# EAGLE schematic 8_bit_Right_Rev_A (EAGLE 9.6.0)

## Sheet 1 of 6: PC
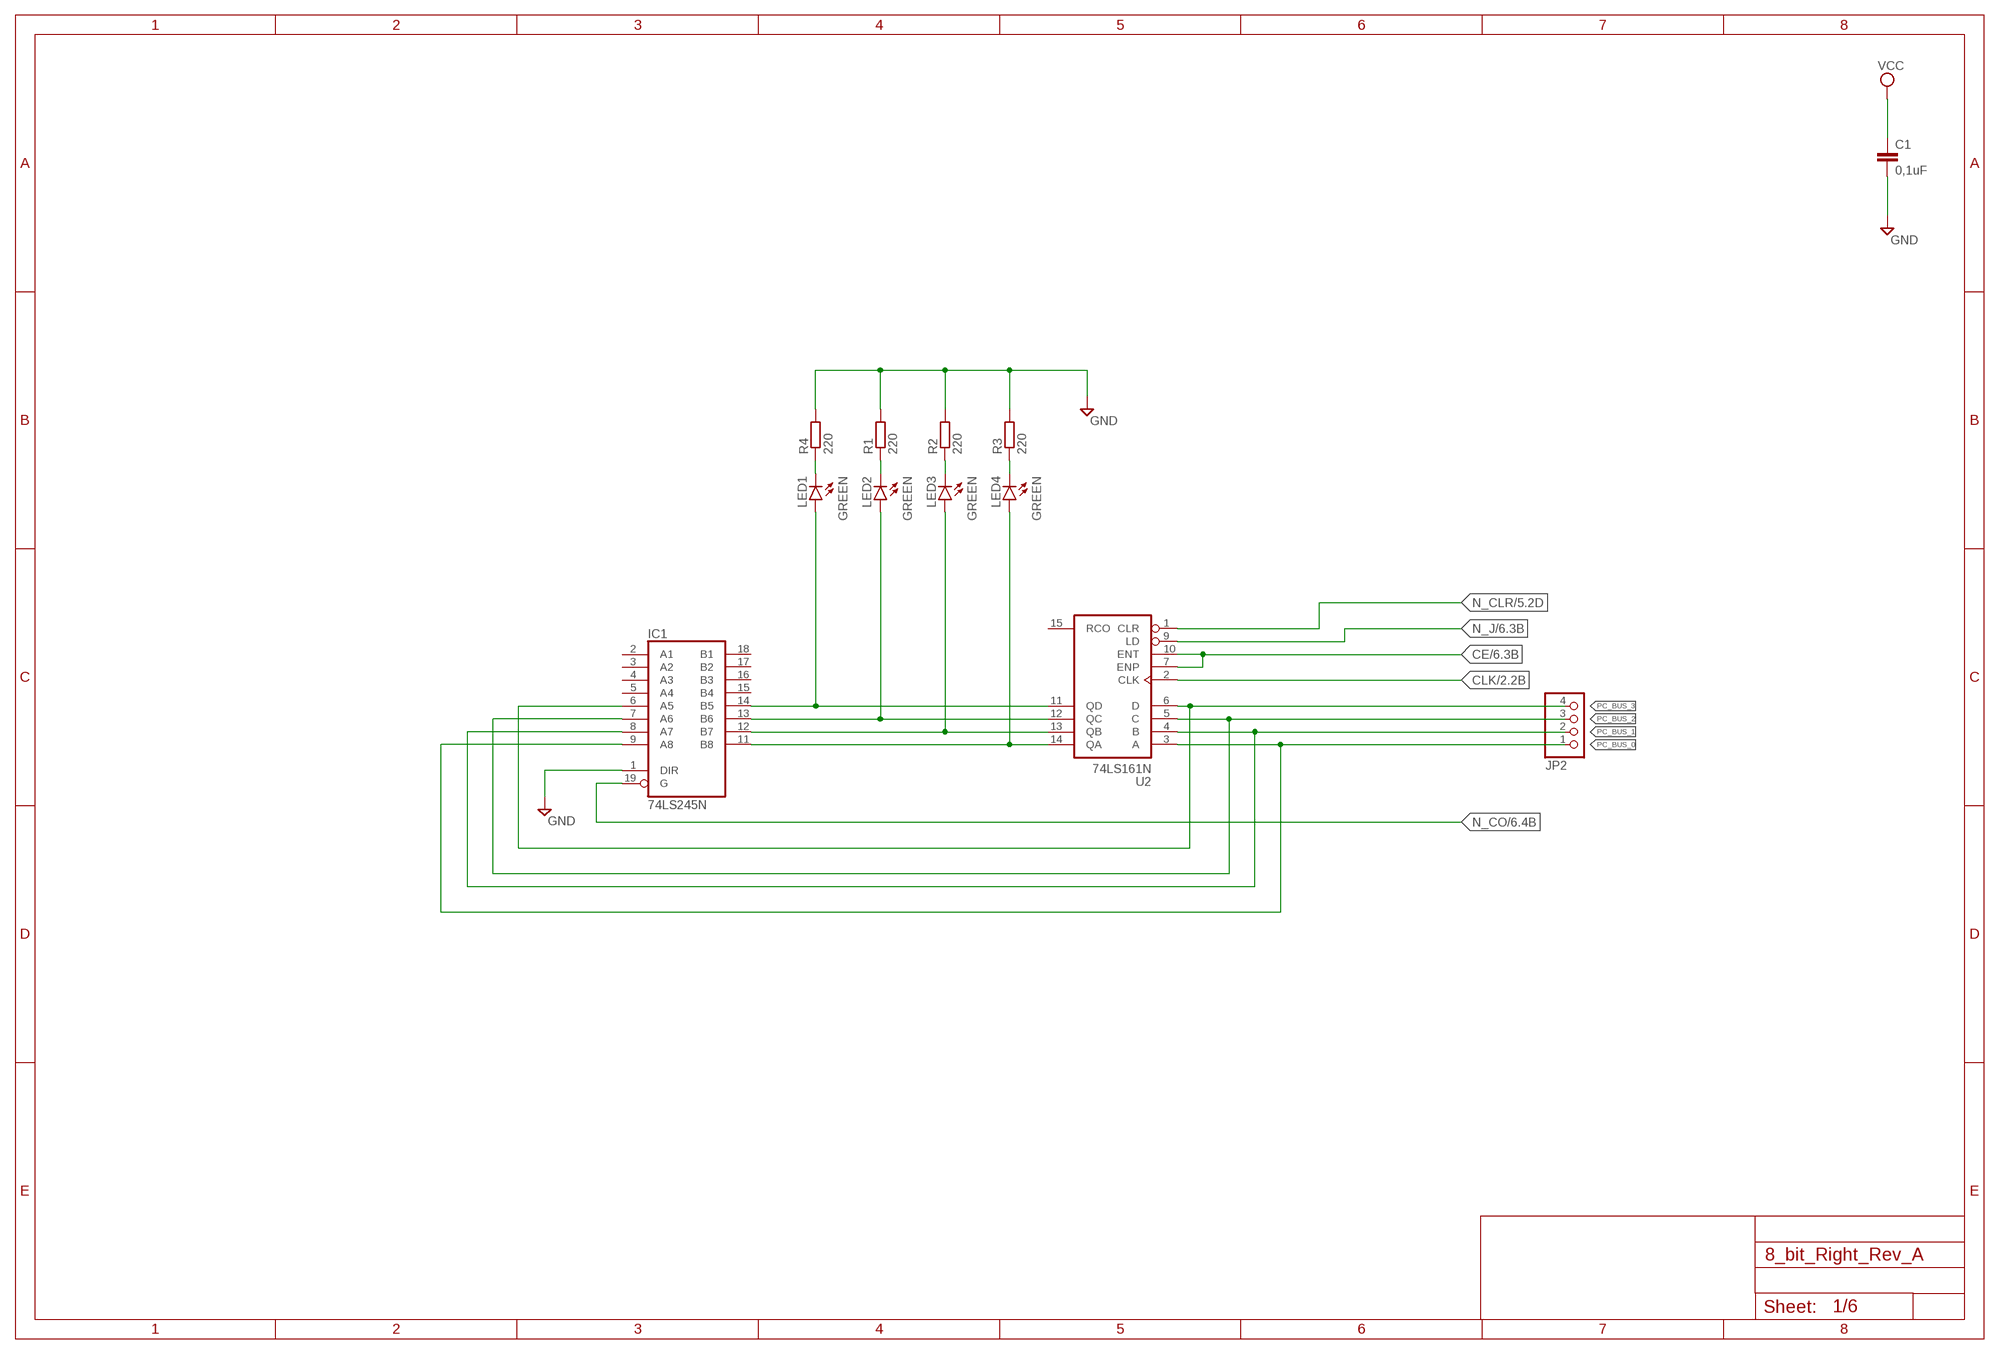
[diagram p0: schematic, sheet 1]

### Parts
C1  0,1uF  C-EU025-030X050  [C025-030X050]
IC1  74LS245N  [DIL20]
JP2  PINHD-1X4  [1X04]
LED1  GREEN  LED5MM  [LED5MM]
LED2  GREEN  LED5MM  [LED5MM]
LED3  GREEN  LED5MM  [LED5MM]
LED4  GREEN  LED5MM  [LED5MM]
R1  220  R-EU_0207/10  [0207/10]
R2  220  R-EU_0207/10  [0207/10]
R3  220  R-EU_0207/10  [0207/10]
R4  220  R-EU_0207/10  [0207/10]
U2  74LS161N  [DIL16]

### Nets
CE: U2.7(ENP) U2.10(ENT) ; also sheet 6
CLK: U2.2(CLK) ; also sheet 2,3,4,5,6
GND: C1.2 IC1.1(DIR) R1.2 R2.2 R3.2 R4.2 ; also sheet 2,3,4,5,6
N$1: LED1.K(C) R4.1
N$2: LED2.K(C) R1.1
N$3: LED3.K(C) R2.1
N$4: LED4.K(C) R3.1
N$5: IC1.11(B8) LED4.A U2.14(QA)
N$6: IC1.12(B7) LED3.A U2.13(QB)
N$7: IC1.13(B6) LED2.A U2.12(QC)
N$8: IC1.14(B5) LED1.A U2.11(QD)
N_CLR: U2.1(CLR) ; also sheet 5,6
N_CO: IC1.19(G) ; also sheet 6
N_J: U2.9(LD) ; also sheet 6
PC_BUS_0: IC1.9(A8) JP2.1 U2.3(A)
PC_BUS_1: IC1.8(A7) JP2.2 U2.4(B)
PC_BUS_2: IC1.7(A6) JP2.3 U2.5(C)
PC_BUS_3: IC1.6(A5) JP2.4 U2.6(D)
VCC: C1.1 ; also sheet 2,3,4,5,6
Unconnected: IC1.2(A1) IC1.3(A2) IC1.4(A3) IC1.5(A4) IC1.15(B4) IC1.16(B3) IC1.17(B2) IC1.18(B1) U2.15(RCO)

## Sheet 2 of 6: A_Register
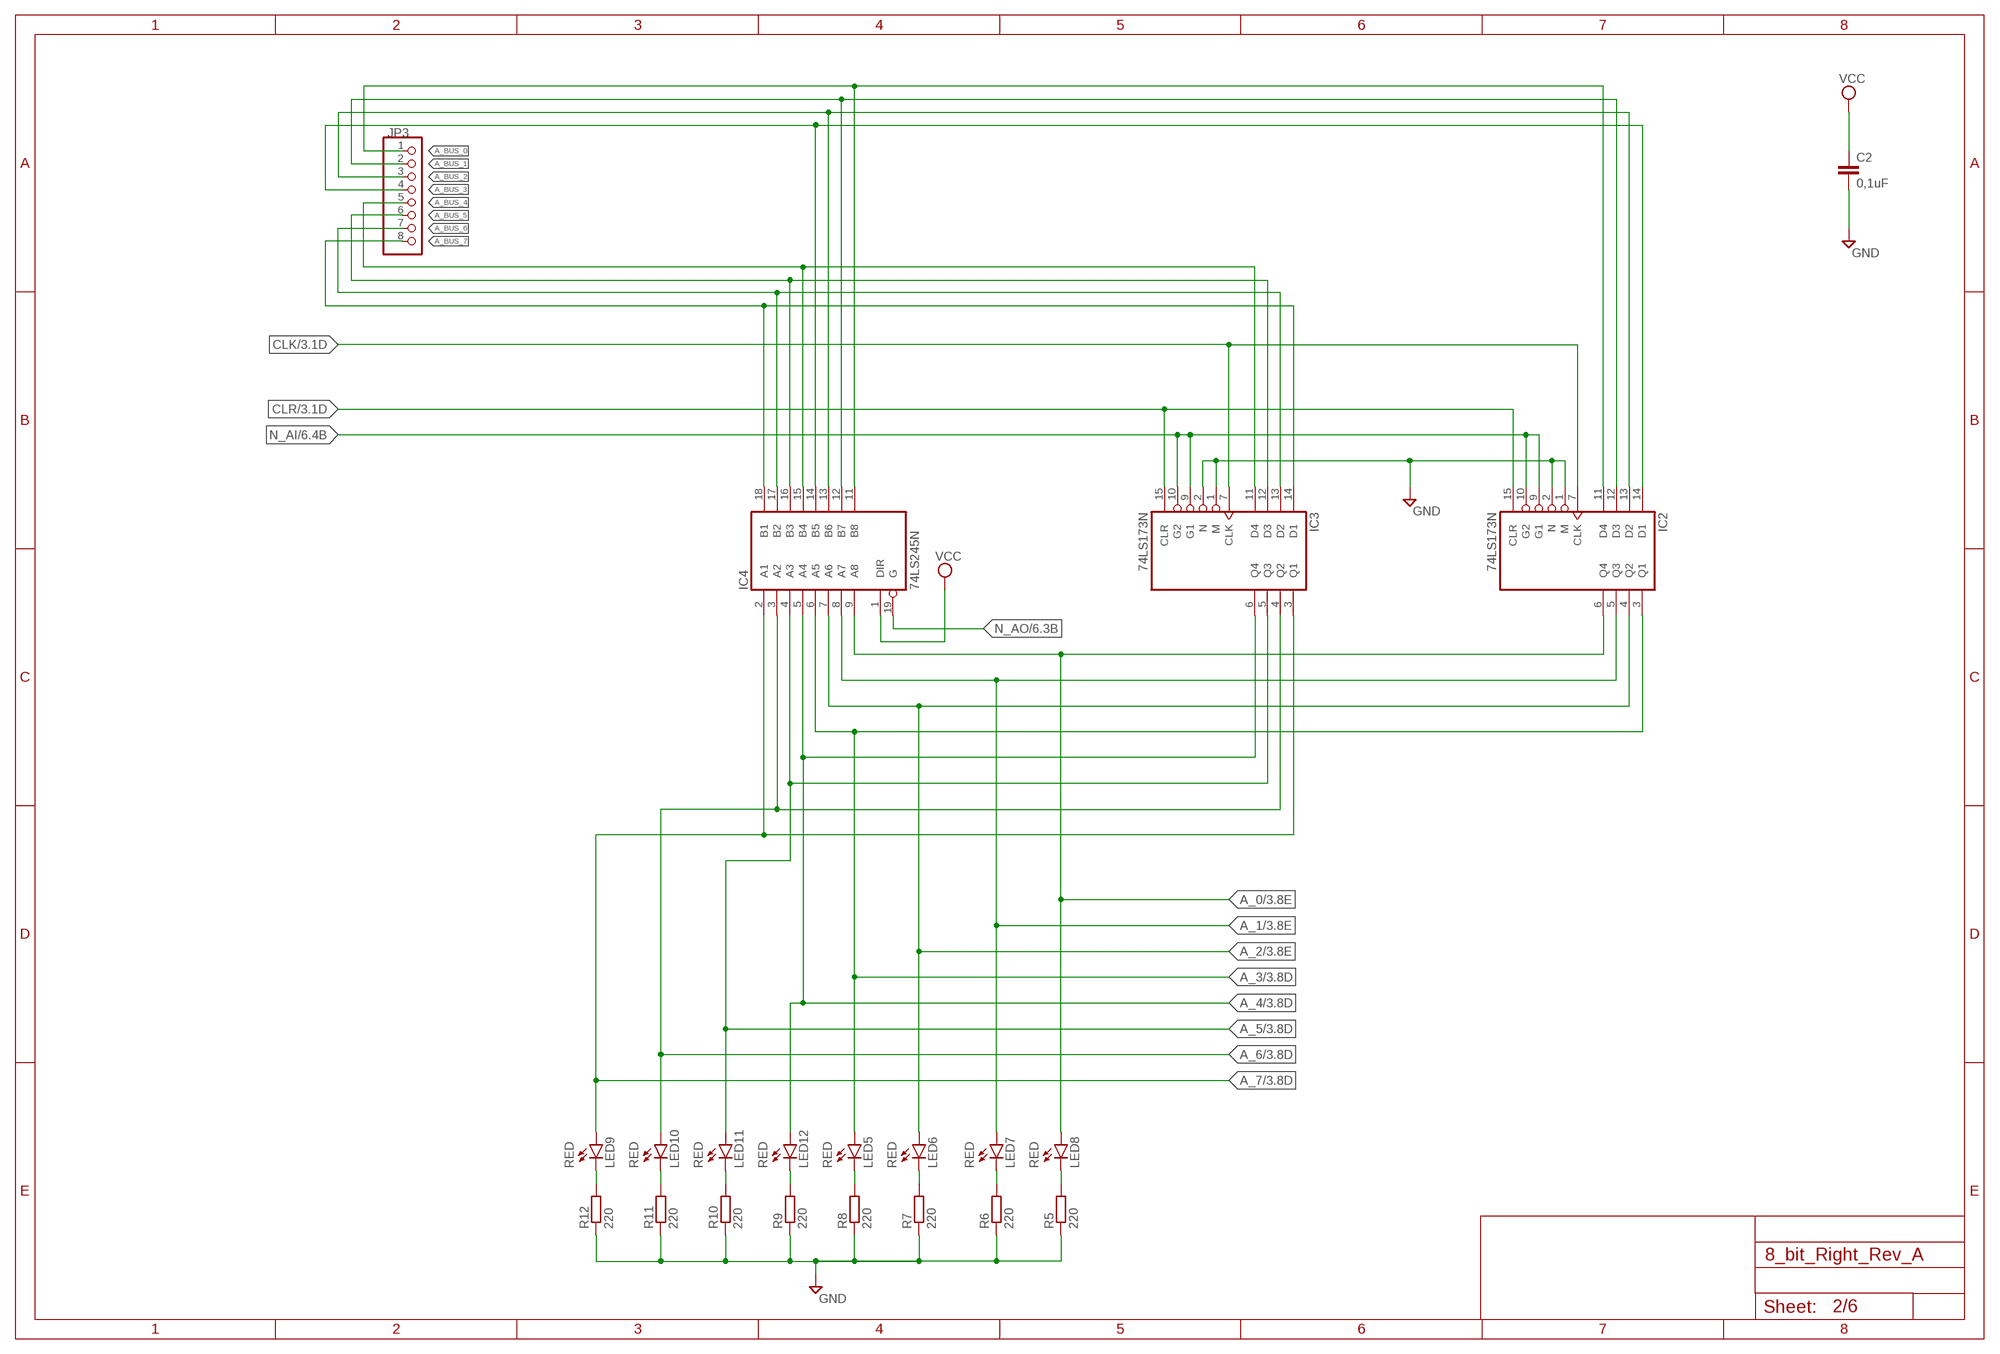
[diagram p1: schematic, sheet 2]

### Parts
C2  0,1uF  C-EU025-030X050  [C025-030X050]
IC2  74LS173N  [DIL16]
IC3  74LS173N  [DIL16]
IC4  74LS245N  [DIL20]
JP3  PINHD-1X8  [1X08]
LED5  RED  LED5MM  [LED5MM]
LED6  RED  LED5MM  [LED5MM]
LED7  RED  LED5MM  [LED5MM]
LED8  RED  LED5MM  [LED5MM]
LED9  RED  LED5MM  [LED5MM]
LED10  RED  LED5MM  [LED5MM]
LED11  RED  LED5MM  [LED5MM]
LED12  RED  LED5MM  [LED5MM]
R5  220  R-EU_0207/10  [0207/10]
R6  220  R-EU_0207/10  [0207/10]
R7  220  R-EU_0207/10  [0207/10]
R8  220  R-EU_0207/10  [0207/10]
R9  220  R-EU_0207/10  [0207/10]
R10  220  R-EU_0207/10  [0207/10]
R11  220  R-EU_0207/10  [0207/10]
R12  220  R-EU_0207/10  [0207/10]

### Nets
A_0: IC2.6(Q4) IC4.9(A8) LED8.A ; also sheet 3
A_1: IC2.5(Q3) IC4.8(A7) LED7.A ; also sheet 3
A_2: IC2.4(Q2) IC4.7(A6) LED6.A ; also sheet 3
A_3: IC2.3(Q1) IC4.6(A5) LED5.A ; also sheet 3
A_4: IC3.6(Q4) IC4.5(A4) LED12.A ; also sheet 3
A_5: IC3.5(Q3) IC4.4(A3) LED11.A ; also sheet 3
A_6: IC3.4(Q2) IC4.3(A2) LED10.A ; also sheet 3
A_7: IC3.3(Q1) IC4.2(A1) LED9.A ; also sheet 3
A_BUS_0: IC2.11(D4) IC4.11(B8) JP3.1
A_BUS_1: IC2.12(D3) IC4.12(B7) JP3.2
A_BUS_2: IC2.13(D2) IC4.13(B6) JP3.3
A_BUS_3: IC2.14(D1) IC4.14(B5) JP3.4
A_BUS_4: IC3.11(D4) IC4.15(B4) JP3.5
A_BUS_5: IC3.12(D3) IC4.16(B3) JP3.6
A_BUS_6: IC3.13(D2) IC4.17(B2) JP3.7
A_BUS_7: IC3.14(D1) IC4.18(B1) JP3.8
CLK: IC2.7(CLK) IC3.7(CLK) ; also sheet 1,3,4,5,6
CLR: IC2.15(CLR) IC3.15(CLR) ; also sheet 3,4
GND: C2.2 IC2.1(M) IC2.2(N) IC3.1(M) IC3.2(N) R5.1 R6.1 R7.1 R8.1 R9.1 R10.1 R11.1 R12.1 ; also sheet 1,3,4,5,6
GND1: LED8.K(C) R5.2
GND2: LED7.K(C) R6.2
GND3: LED6.K(C) R7.2
GND4: LED5.K(C) R8.2
GND5: LED12.K(C) R9.2
GND6: LED11.K(C) R10.2
GND7: LED10.K(C) R11.2
GND8: LED9.K(C) R12.2
N_AI: IC2.9(G1) IC2.10(G2) IC3.9(G1) IC3.10(G2) ; also sheet 6
N_AO: IC4.19(G) ; also sheet 6
VCC: C2.1 IC4.1(DIR) ; also sheet 1,3,4,5,6

## Sheet 3 of 6: Arthemtical Logic Unit
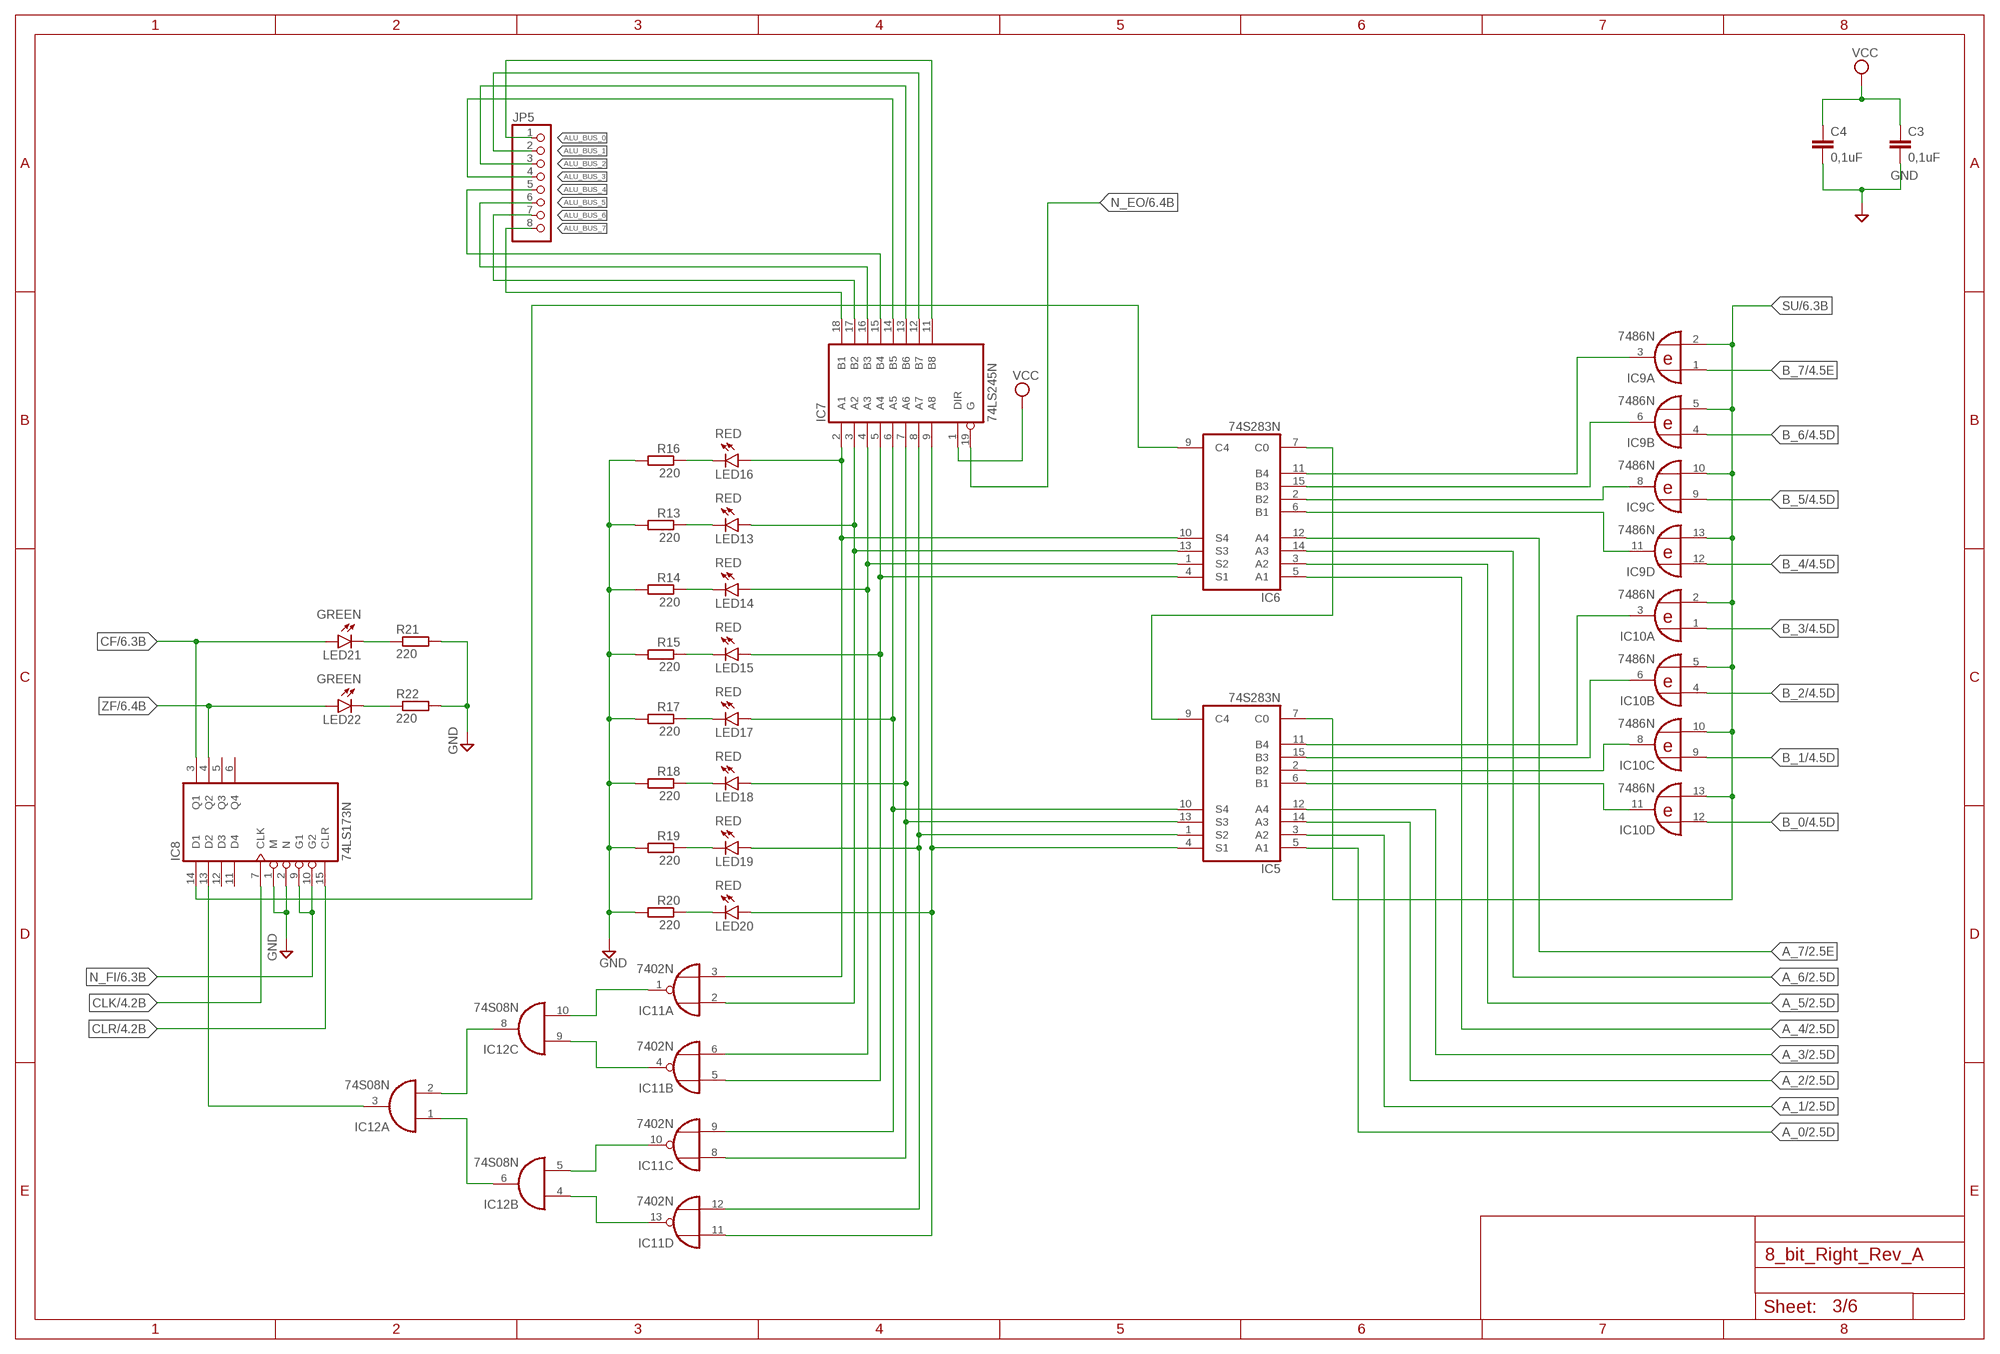
[diagram p2: schematic, sheet 3]

### Parts
C3  0,1uF  C-EU025-030X050  [C025-030X050]
C4  0,1uF  C-EU025-030X050  [C025-030X050]
IC5  74S283N  [DIL16]
IC6  74S283N  [DIL16]
IC7  74LS245N  [DIL20]
IC8  74LS173N  [DIL16]
IC9  7486N  [DIL14]
IC10  7486N  [DIL14]
IC11  7402N  [DIL14]
IC12  74S08N  [DIL14]
JP5  PINHD-1X8  [1X08]
LED13  RED  LED5MM  [LED5MM]
LED14  RED  LED5MM  [LED5MM]
LED15  RED  LED5MM  [LED5MM]
LED16  RED  LED5MM  [LED5MM]
LED17  RED  LED5MM  [LED5MM]
LED18  RED  LED5MM  [LED5MM]
LED19  RED  LED5MM  [LED5MM]
LED20  RED  LED5MM  [LED5MM]
LED21  GREEN  LED5MM  [LED5MM]
LED22  GREEN  LED5MM  [LED5MM]
R13  220  R-EU_0207/10  [0207/10]
R14  220  R-EU_0207/10  [0207/10]
R15  220  R-EU_0207/10  [0207/10]
R16  220  R-EU_0207/10  [0207/10]
R17  220  R-EU_0207/10  [0207/10]
R18  220  R-EU_0207/10  [0207/10]
R19  220  R-EU_0207/10  [0207/10]
R20  220  R-EU_0207/10  [0207/10]
R21  220  R-EU_0207/10  [0207/10]
R22  220  R-EU_0207/10  [0207/10]

### Nets
A_0: IC5.5(A1) ; also sheet 2
A_1: IC5.3(A2) ; also sheet 2
A_2: IC5.14(A3) ; also sheet 2
A_3: IC5.12(A4) ; also sheet 2
A_4: IC6.5(A1) ; also sheet 2
A_5: IC6.3(A2) ; also sheet 2
A_6: IC6.14(A3) ; also sheet 2
A_7: IC6.12(A4) ; also sheet 2
ALU_BUS_0: IC7.11(B8) JP5.1
ALU_BUS_1: IC7.12(B7) JP5.2
ALU_BUS_2: IC7.13(B6) JP5.3
ALU_BUS_3: IC7.14(B5) JP5.4
ALU_BUS_4: IC7.15(B4) JP5.5
ALU_BUS_5: IC7.16(B3) JP5.6
ALU_BUS_6: IC7.17(B2) JP5.7
ALU_BUS_7: IC7.18(B1) JP5.8
B_0: IC10.12(D:I0) ; also sheet 4
B_1: IC10.9(C:I0) ; also sheet 4
B_2: IC10.4(B:I0) ; also sheet 4
B_3: IC10.1(A:I0) ; also sheet 4
B_4: IC9.12(D:I0) ; also sheet 4
B_5: IC9.9(C:I0) ; also sheet 4
B_6: IC9.4(B:I0) ; also sheet 4
B_7: IC9.1(A:I0) ; also sheet 4
CF: IC8.3(Q1) LED21.A ; also sheet 6
CLK: IC8.7(CLK) ; also sheet 1,2,4,5,6
CLR: IC8.15(CLR) ; also sheet 2,4
GND: C3.2 C4.2 IC8.1(M) IC8.2(N) R13.2 R14.2 R15.2 R16.2 R17.2 R18.2 R19.2 R20.2 R21.2 R22.2 ; also sheet 1,2,4,5,6
N$9: IC5.9(C4) IC6.7(C0)
N$10: IC6.11(B4) IC9.3(A:O)
N$11: IC6.15(B3) IC9.6(B:O)
N$12: IC6.2(B2) IC9.8(C:O)
N$13: IC6.6(B1) IC9.11(D:O)
N$14: IC5.11(B4) IC10.3(A:O)
N$15: IC5.15(B3) IC10.6(B:O)
N$16: IC5.2(B2) IC10.8(C:O)
N$17: IC5.6(B1) IC10.11(D:O)
N$18: LED13.K(C) R13.1
N$19: LED14.K(C) R14.1
N$20: LED15.K(C) R15.1
N$21: LED16.K(C) R16.1
N$22: LED17.K(C) R17.1
N$23: LED18.K(C) R18.1
N$24: LED19.K(C) R19.1
N$25: LED20.K(C) R20.1
N$26: IC6.10(S4) IC7.2(A1) IC11.3(A:I1) LED16.A
N$27: IC6.13(S3) IC7.3(A2) IC11.2(A:I0) LED13.A
N$28: IC6.1(S2) IC7.4(A3) IC11.6(B:I1) LED14.A
N$29: IC6.4(S1) IC7.5(A4) IC11.5(B:I0) LED15.A
N$30: IC5.10(S4) IC7.6(A5) IC11.9(C:I1) LED17.A
N$31: IC5.13(S3) IC7.7(A6) IC11.8(C:I0) LED18.A
N$32: IC5.1(S2) IC7.8(A7) IC11.12(D:I1) LED19.A
N$33: IC5.4(S1) IC7.9(A8) IC11.11(D:I0) LED20.A
N$34: IC11.1(A:O) IC12.10(C:I1)
N$35: IC11.4(B:O) IC12.9(C:I0)
N$36: IC11.10(C:O) IC12.5(B:I1)
N$37: IC11.13(D:O) IC12.4(B:I0)
N$38: IC12.1(A:I0) IC12.6(B:O)
N$39: IC12.2(A:I1) IC12.8(C:O)
N$40: IC8.13(D2) IC12.3(A:O)
N$41: IC6.9(C4) IC8.14(D1)
N$42: LED21.K(C) R21.1
N$43: LED22.K(C) R22.1
N_EO: IC7.19(G) ; also sheet 6
N_FI: IC8.9(G1) IC8.10(G2) ; also sheet 6
SU: IC5.7(C0) IC9.2(A:I1) IC9.5(B:I1) IC9.10(C:I1) IC9.13(D:I1) IC10.2(A:I1) IC10.5(B:I1) IC10.10(C:I1) IC10.13(D:I1) ; also sheet 6
VCC: C3.1 C4.1 IC7.1(DIR) ; also sheet 1,2,4,5,6
ZF: IC8.4(Q2) LED22.A ; also sheet 6
Unconnected: IC8.5(Q3) IC8.6(Q4) IC8.11(D4) IC8.12(D3) IC12.11(D:O) IC12.12(D:I0) IC12.13(D:I1)

## Sheet 4 of 6: B register
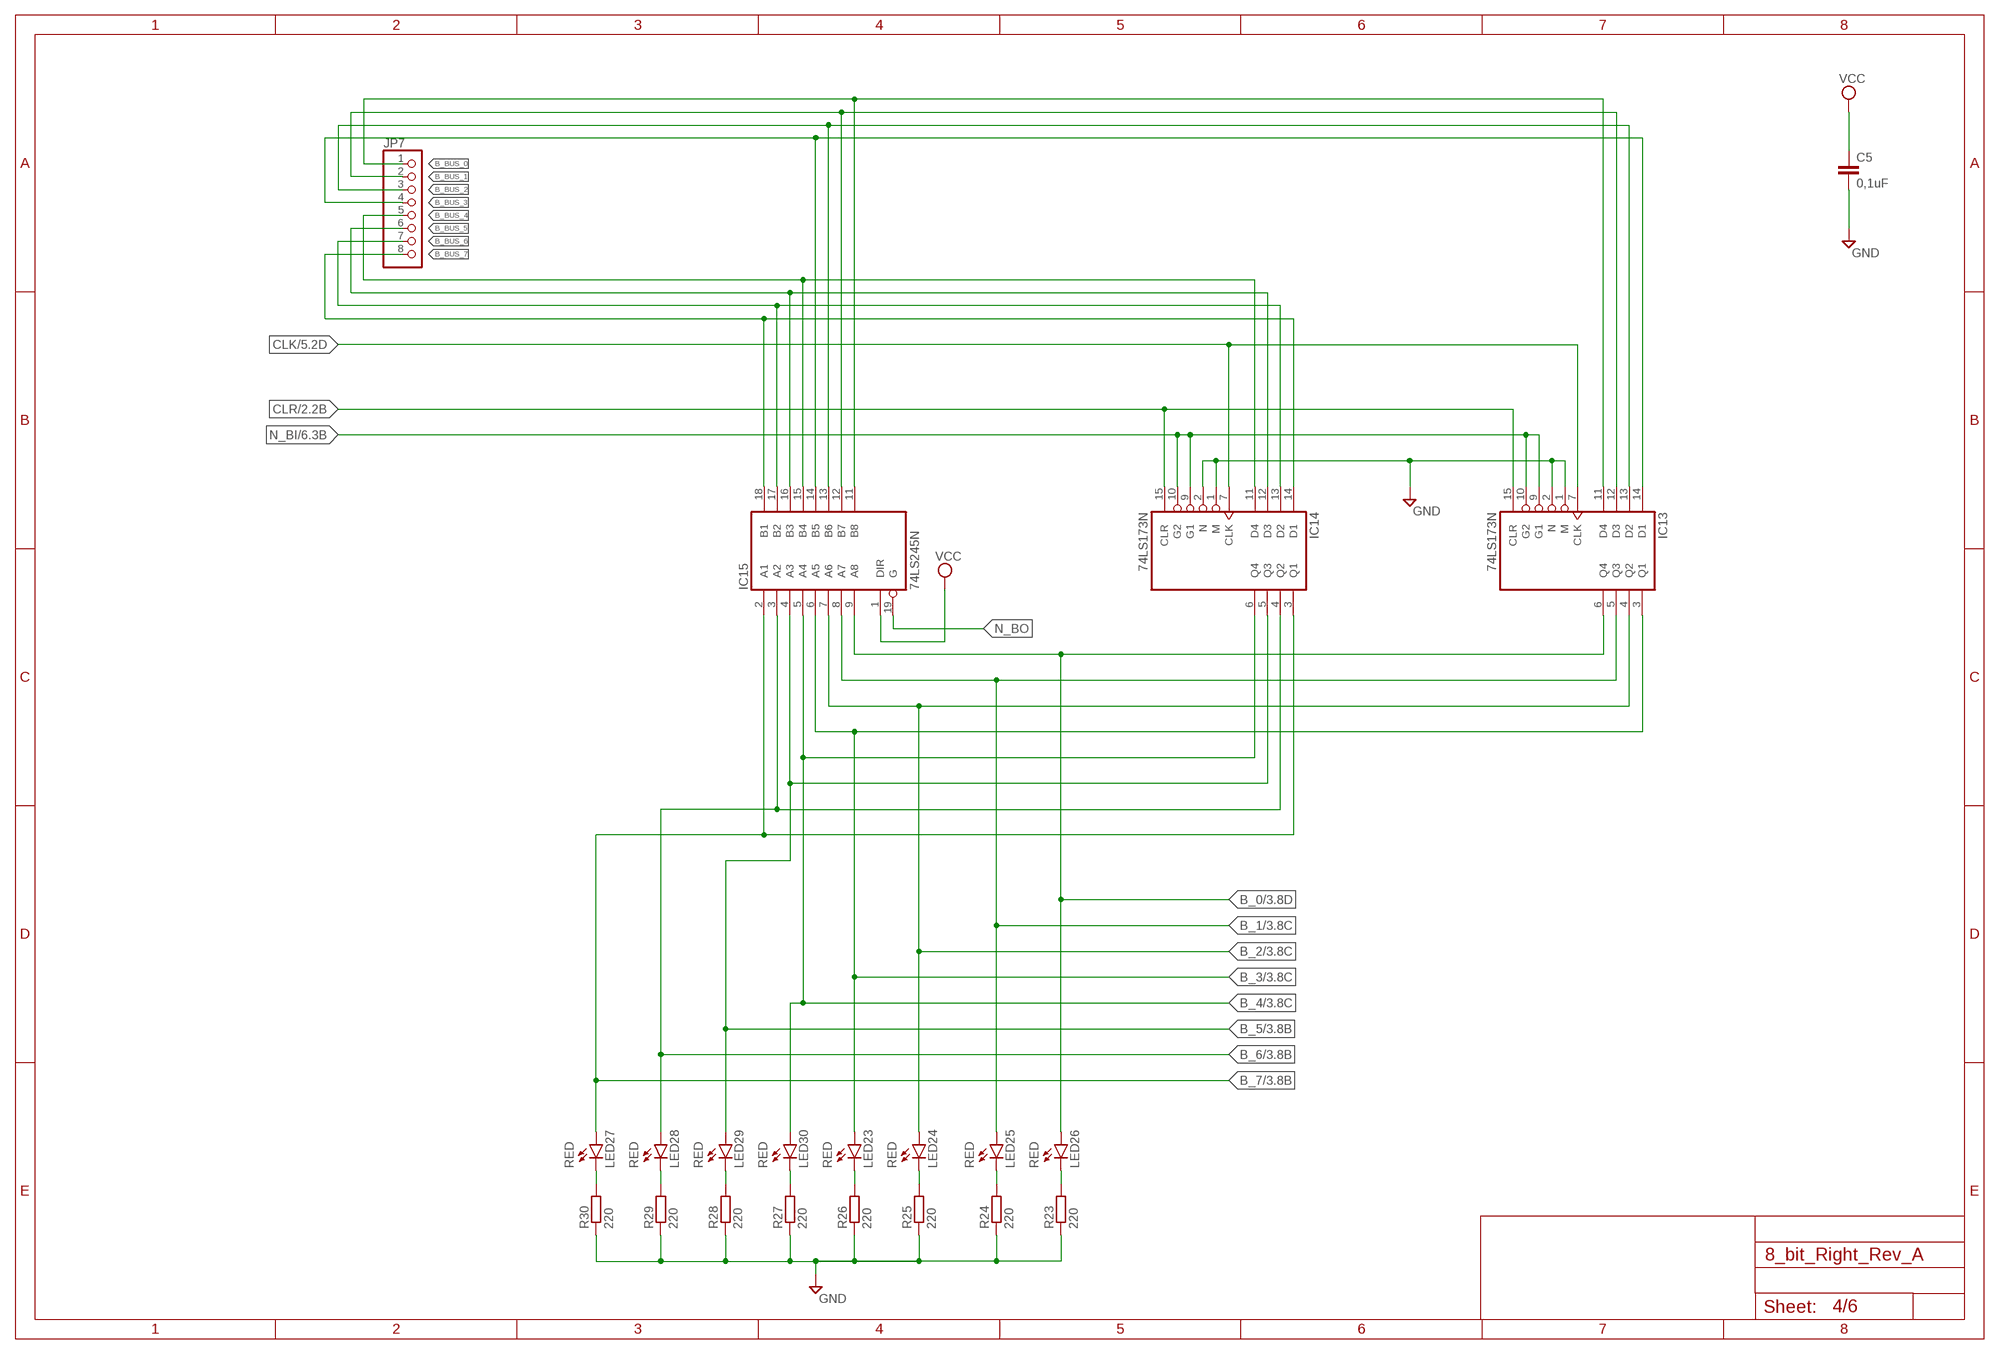
[diagram p3: schematic, sheet 4]

### Parts
C5  0,1uF  C-EU025-030X050  [C025-030X050]
IC13  74LS173N  [DIL16]
IC14  74LS173N  [DIL16]
IC15  74LS245N  [DIL20]
JP7  PINHD-1X8  [1X08]
LED23  RED  LED5MM  [LED5MM]
LED24  RED  LED5MM  [LED5MM]
LED25  RED  LED5MM  [LED5MM]
LED26  RED  LED5MM  [LED5MM]
LED27  RED  LED5MM  [LED5MM]
LED28  RED  LED5MM  [LED5MM]
LED29  RED  LED5MM  [LED5MM]
LED30  RED  LED5MM  [LED5MM]
R23  220  R-EU_0207/10  [0207/10]
R24  220  R-EU_0207/10  [0207/10]
R25  220  R-EU_0207/10  [0207/10]
R26  220  R-EU_0207/10  [0207/10]
R27  220  R-EU_0207/10  [0207/10]
R28  220  R-EU_0207/10  [0207/10]
R29  220  R-EU_0207/10  [0207/10]
R30  220  R-EU_0207/10  [0207/10]

### Nets
B_0: IC13.6(Q4) IC15.9(A8) LED26.A ; also sheet 3
B_1: IC13.5(Q3) IC15.8(A7) LED25.A ; also sheet 3
B_2: IC13.4(Q2) IC15.7(A6) LED24.A ; also sheet 3
B_3: IC13.3(Q1) IC15.6(A5) LED23.A ; also sheet 3
B_4: IC14.6(Q4) IC15.5(A4) LED30.A ; also sheet 3
B_5: IC14.5(Q3) IC15.4(A3) LED29.A ; also sheet 3
B_6: IC14.4(Q2) IC15.3(A2) LED28.A ; also sheet 3
B_7: IC14.3(Q1) IC15.2(A1) LED27.A ; also sheet 3
B_BUS_0: IC13.11(D4) IC15.11(B8) JP7.1
B_BUS_1: IC13.12(D3) IC15.12(B7) JP7.2
B_BUS_2: IC13.13(D2) IC15.13(B6) JP7.3
B_BUS_3: IC13.14(D1) IC15.14(B5) JP7.4
B_BUS_4: IC14.11(D4) IC15.15(B4) JP7.5
B_BUS_5: IC14.12(D3) IC15.16(B3) JP7.6
B_BUS_6: IC14.13(D2) IC15.17(B2) JP7.7
B_BUS_7: IC14.14(D1) IC15.18(B1) JP7.8
CLK: IC13.7(CLK) IC14.7(CLK) ; also sheet 1,2,3,5,6
CLR: IC13.15(CLR) IC14.15(CLR) ; also sheet 2,3
GND: C5.2 IC13.1(M) IC13.2(N) IC14.1(M) IC14.2(N) R23.1 R24.1 R25.1 R26.1 R27.1 R28.1 R29.1 R30.1 ; also sheet 1,2,3,5,6
GND9: LED26.K(C) R23.2
GND10: LED25.K(C) R24.2
GND11: LED24.K(C) R25.2
GND12: LED23.K(C) R26.2
GND13: LED30.K(C) R27.2
GND14: LED29.K(C) R28.2
GND15: LED28.K(C) R29.2
GND16: LED27.K(C) R30.2
N_BI: IC13.9(G1) IC13.10(G2) IC14.9(G1) IC14.10(G2) ; also sheet 6
N_BO: IC15.19(G)
VCC: C5.1 IC15.1(DIR) ; also sheet 1,2,3,5,6

## Sheet 5 of 6: Output
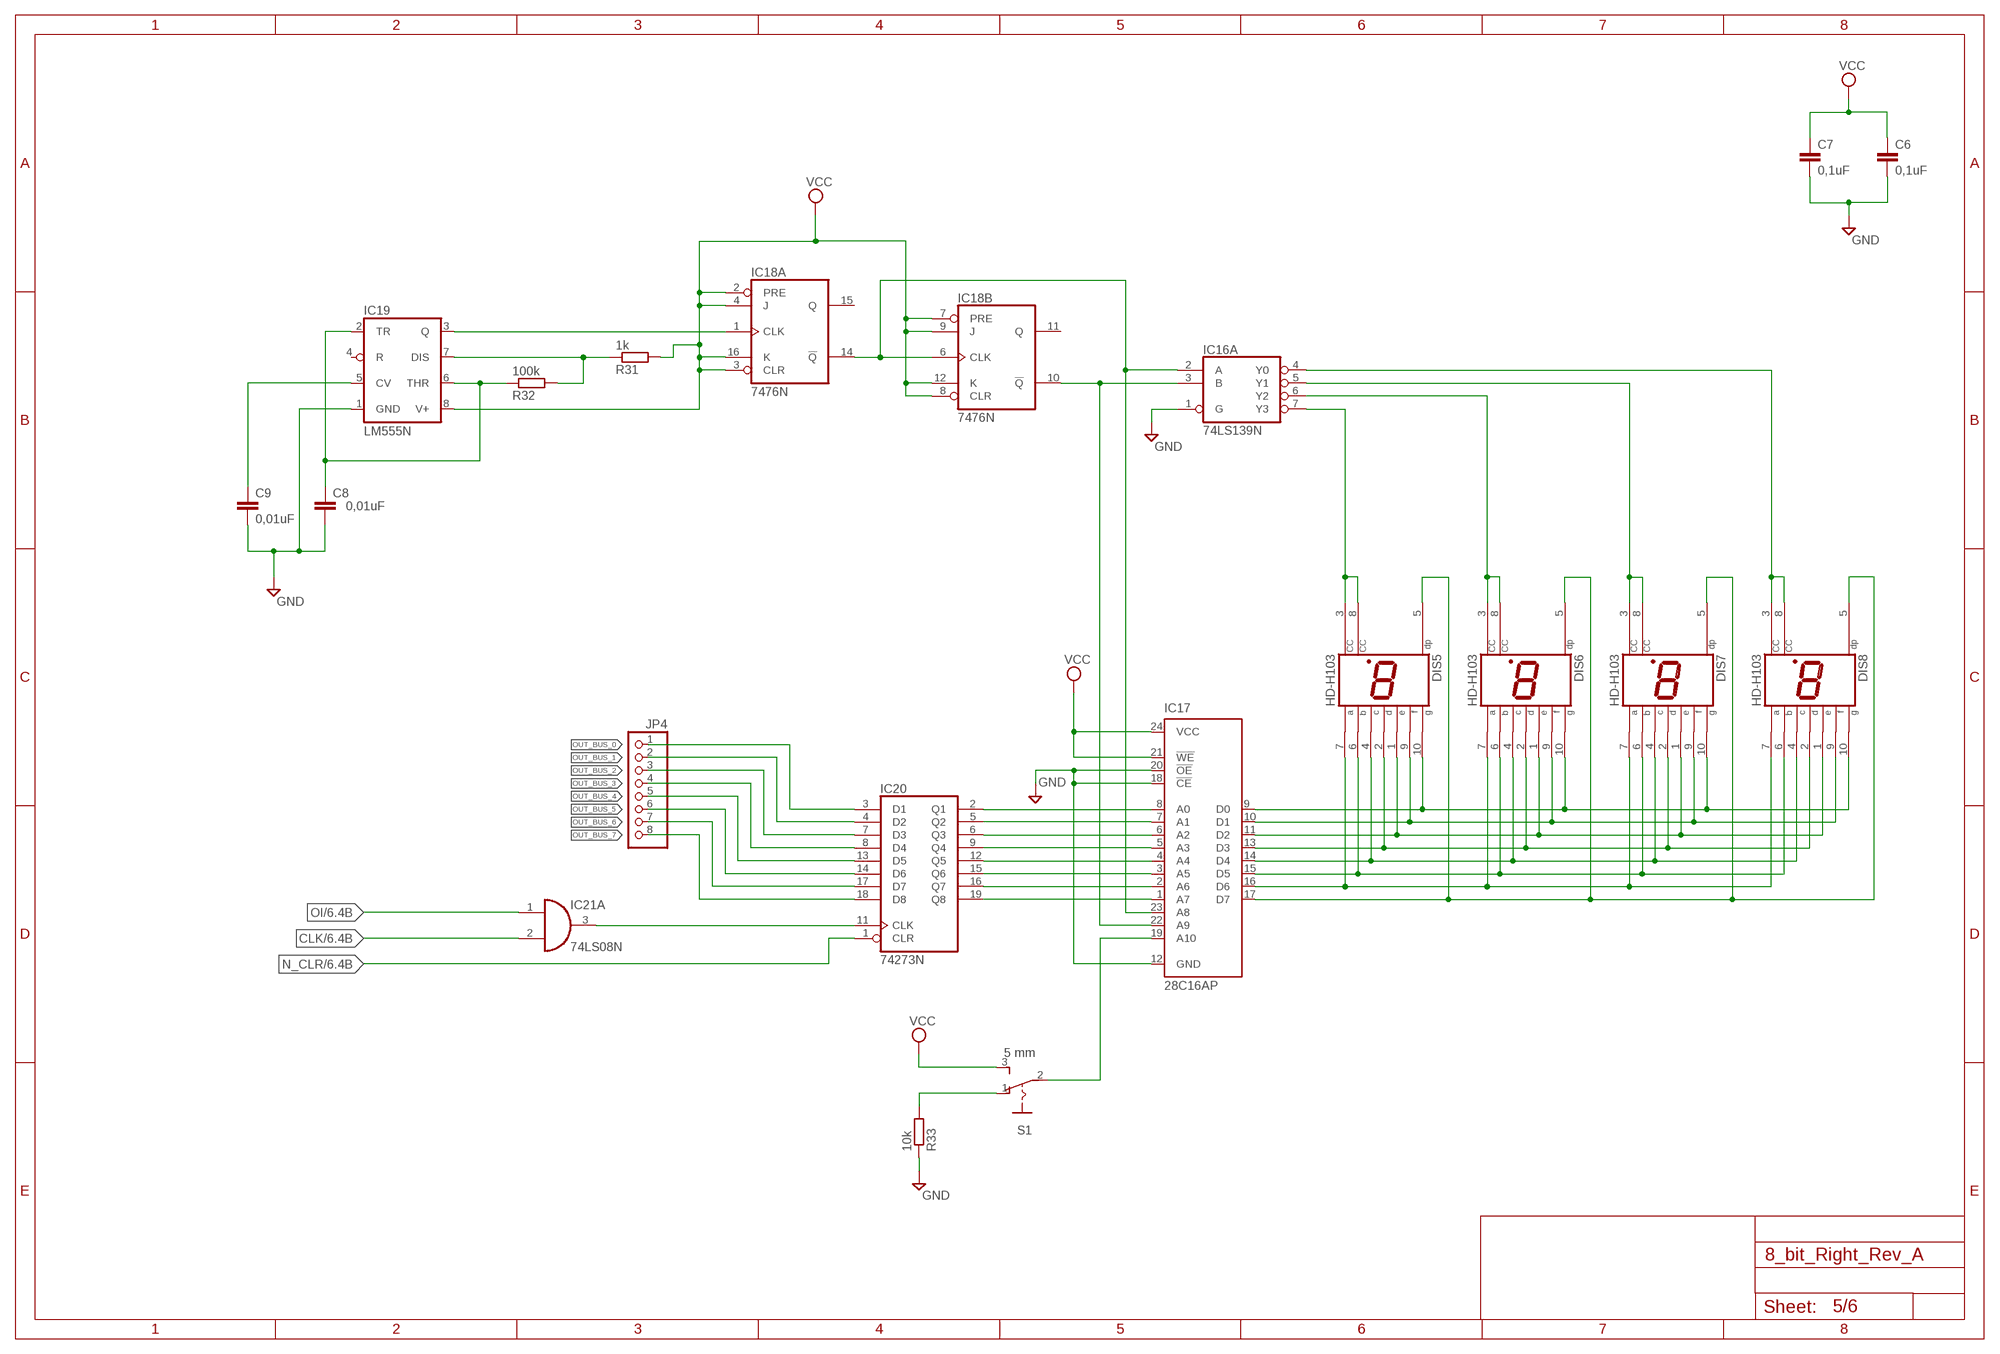
[diagram p4: schematic, sheet 5]

### Parts
C6  0,1uF  C-EU025-030X050  [C025-030X050]
C7  0,1uF  C-EU025-030X050  [C025-030X050]
C8  0,01uF  C-EU025-030X050  [C025-030X050]
C9  0,01uF  C-EU025-030X050  [C025-030X050]
DIS5  HD-H103  [HDSP-M]
DIS6  HD-H103  [HDSP-M]
DIS7  HD-H103  [HDSP-M]
DIS8  HD-H103  [HDSP-M]
IC16  74LS139N  [DIL16]
IC17  28C16AP  [DIL24-6]
IC18  7476N  [DIL16]
IC19  LM555N  [DIL08]
IC20  74273N  [DIL20]
IC21  74LS08N  [DIL14]
JP4  PINHD-1X8  [1X08]
R31  1k  R-EU_0207/10  [0207/10]
R32  100k  R-EU_0207/10  [0207/10]
R33  10k  R-EU_0207/10  [0207/10]
S1  5 mm  255SB  [255SB]

### Nets
CLK: IC21.2(A:I1) ; also sheet 1,2,3,4,6
GND: C6.2 C7.2 C8.2 C9.2 IC16.1(A:G) IC17.12(GND) IC17.18(!CE) IC17.20(!OE) IC19.1(GND) R33.1 ; also sheet 1,2,3,4,6
N$45: IC17.8(A0) IC20.2(Q1)
N$46: IC17.7(A1) IC20.5(Q2)
N$72: IC17.6(A2) IC20.6(Q3)
N$75: IC17.5(A3) IC20.9(Q4)
N$76: IC17.4(A4) IC20.12(Q5)
N$78: IC17.3(A5) IC20.15(Q6)
N$79: IC17.2(A6) IC20.16(Q7)
N$80: IC17.1(A7) IC20.19(Q8)
N$81: DIS5.5(DP) DIS6.5(DP) DIS7.5(DP) DIS8.5(DP) IC17.17(D7)
N$82: DIS5.7(A) DIS6.7(A) DIS7.7(A) DIS8.7(A) IC17.16(D6)
N$83: DIS5.6(B) DIS6.6(B) DIS7.6(B) DIS8.6(B) IC17.15(D5)
N$84: DIS5.4(C) DIS6.4(C) DIS7.4(C) DIS8.4(C) IC17.14(D4)
N$85: DIS5.2(D) DIS6.2(D) DIS7.2(D) DIS8.2(D) IC17.13(D3)
N$86: DIS5.1(E) DIS6.1(E) DIS7.1(E) DIS8.1(E) IC17.11(D2)
N$87: DIS5.9(F) DIS6.9(F) DIS7.9(F) DIS8.9(F) IC17.10(D1)
N$88: DIS5.10(G) DIS6.10(G) DIS7.10(G) DIS8.10(G) IC17.9(D0)
N$89: DIS5.3(CC) DIS5.8(CC) IC16.7(A:Y3)
N$90: DIS6.3(CC) DIS6.8(CC) IC16.6(A:Y2)
N$91: DIS7.3(CC) DIS7.8(CC) IC16.5(A:Y1)
N$92: DIS8.3(CC) DIS8.8(CC) IC16.4(A:Y0)
N$93: IC16.3(A:B) IC17.22(A9) IC18.10(B:!Q)
N$94: IC16.2(A:A) IC17.23(A8) IC18.6(B:CLK) IC18.14(A:!Q)
N$95: IC18.1(A:CLK) IC19.3(Q)
N$96: IC19.7(DIS) R31.1 R32.2
N$97: C8.1 IC19.2(TR) IC19.6(THR) R32.1
N$98: C9.1 IC19.5(CV)
N$99: IC20.11(CLK) IC21.3(A:O)
N$100: IC17.19(A10) S1.2(P)
N$101: R33.2 S1.1(O)
N_CLR: IC20.1(CLR) ; also sheet 1,6
OI: IC21.1(A:I0) ; also sheet 6
OUT_BUS_0: IC20.3(D1) JP4.1
OUT_BUS_1: IC20.4(D2) JP4.2
OUT_BUS_2: IC20.7(D3) JP4.3
OUT_BUS_3: IC20.8(D4) JP4.4
OUT_BUS_4: IC20.13(D5) JP4.5
OUT_BUS_5: IC20.14(D6) JP4.6
OUT_BUS_6: IC20.17(D7) JP4.7
OUT_BUS_7: IC20.18(D8) JP4.8
VCC: C6.1 C7.1 IC17.21(!WE) IC17.24(VCC) IC18.2(A:PRE) IC18.3(A:CLR) IC18.4(A:J) IC18.7(B:PRE) IC18.8(B:CLR) IC18.9(B:J) IC18.12(B:K) IC18.16(A:K) IC19.8(V+) R31.2 S1.3(S) ; also sheet 1,2,3,4,6
Unconnected: IC16.9(B:Y3) IC16.10(B:Y2) IC16.11(B:Y1) IC16.12(B:Y0) IC16.13(B:B) IC16.14(B:A) IC16.15(B:G) IC18.11(B:Q) IC18.15(A:Q) IC19.4(R) IC21.4(B:I0) IC21.5(B:I1) IC21.6(B:O) IC21.8(C:O) IC21.9(C:I0) IC21.10(C:I1) IC21.11(D:O) IC21.12(D:I0) IC21.13(D:I1)

## Sheet 6 of 6: Stuff
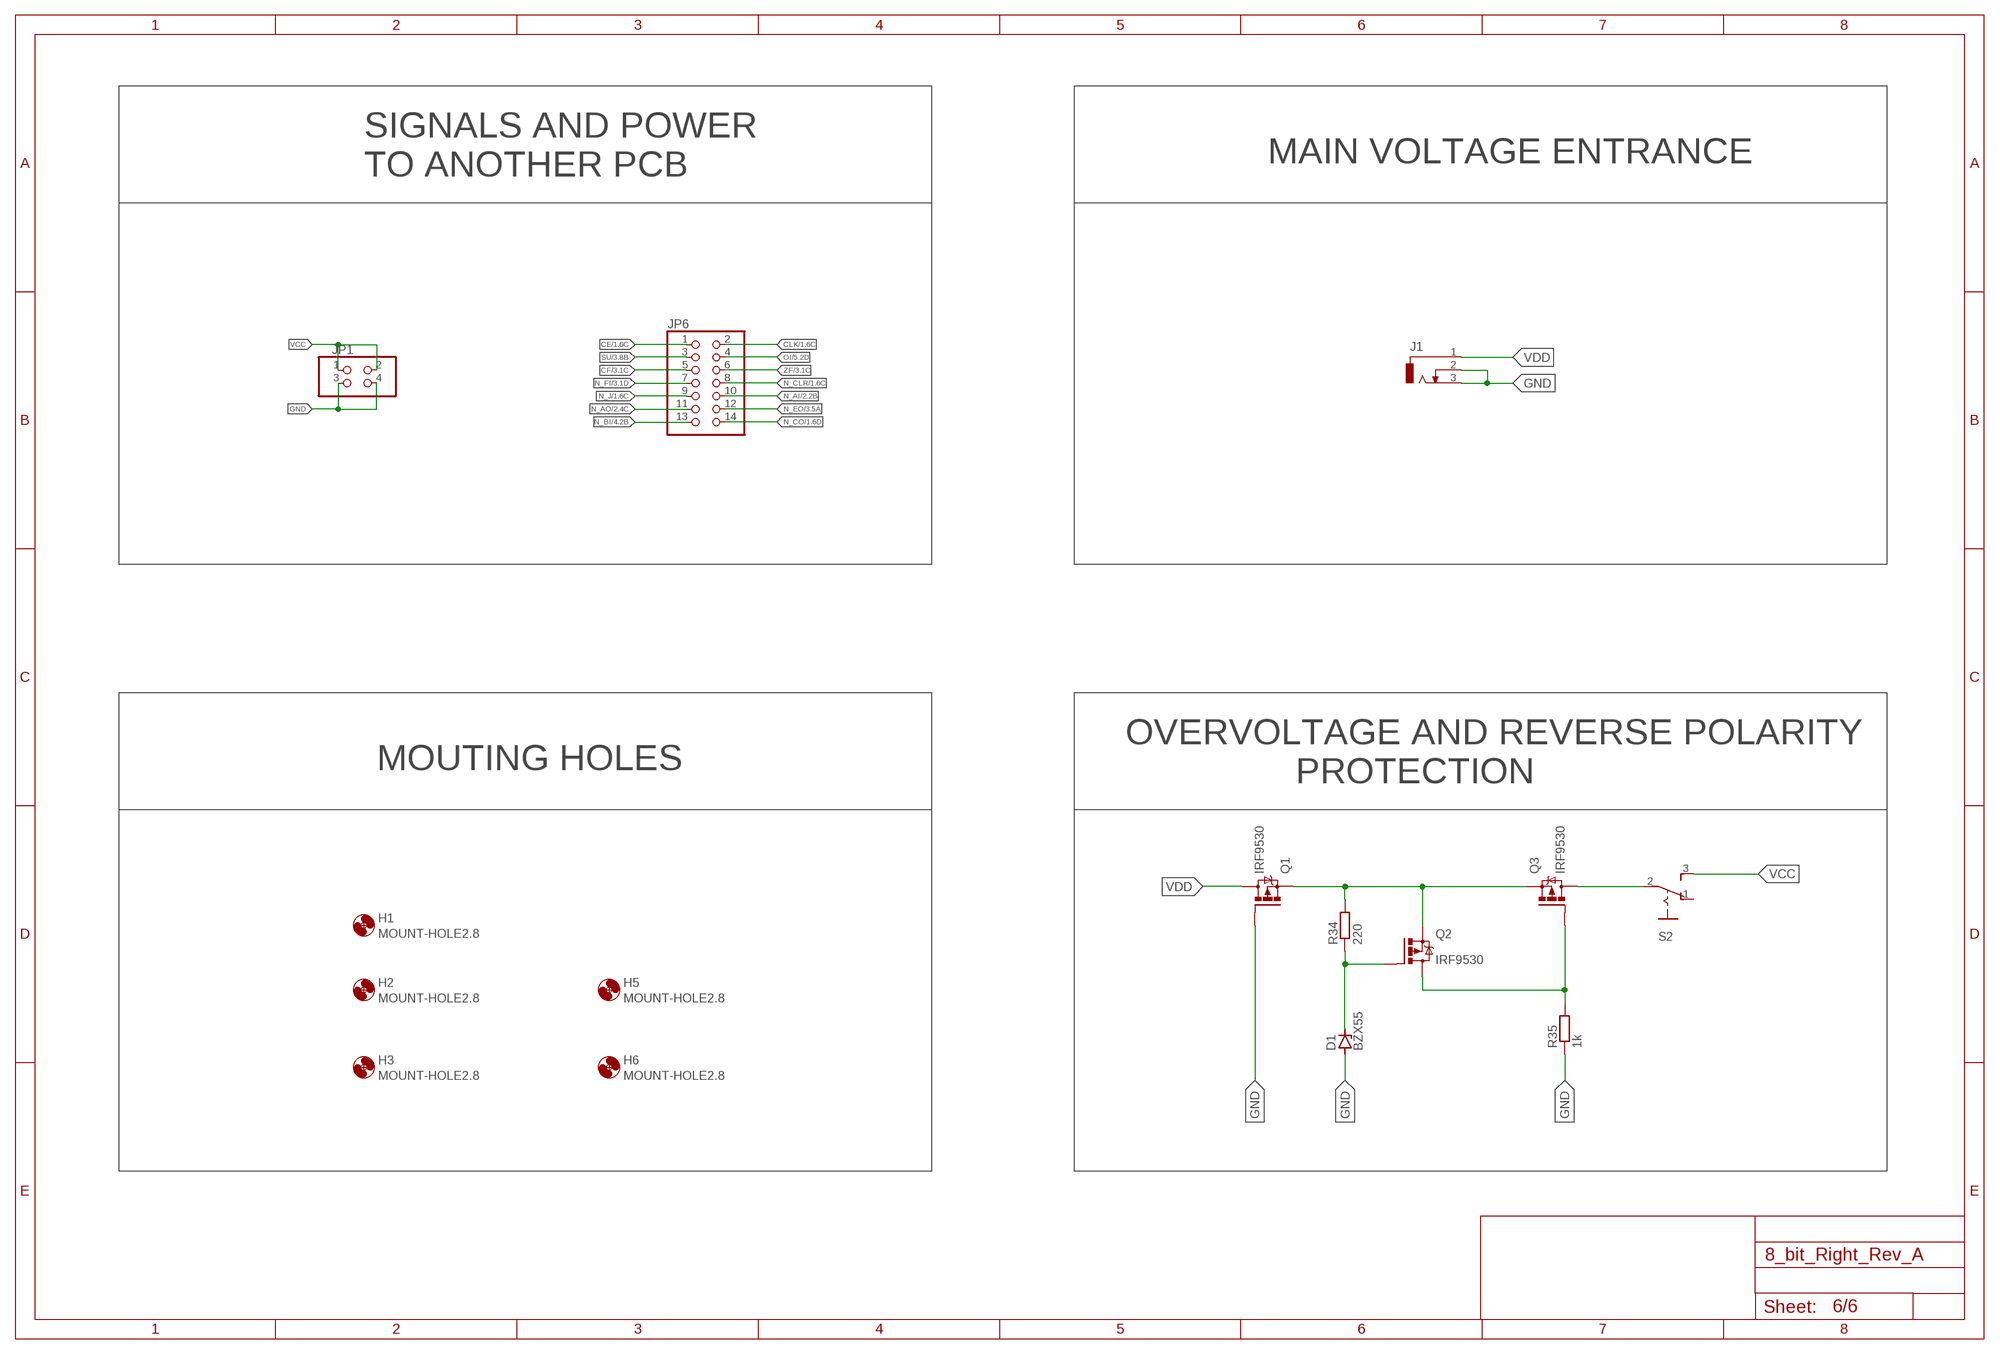
[diagram p5: schematic, sheet 6]

### Parts
D1  BZX55  [DO35Z10]
H1  MOUNT-HOLE2.8  [2,8]
H2  MOUNT-HOLE2.8  [2,8]
H3  MOUNT-HOLE2.8  [2,8]
H5  MOUNT-HOLE2.8  [2,8]
H6  MOUNT-HOLE2.8  [2,8]
J1  DCJ0303  [DCJ0303]
JP1  PINHD-2X2  [2X02]
JP6  PINHD-2X7  [2X07]
Q1  IRF9530  [TO220BV]
Q2  IRF9530  [TO220BV]
Q3  IRF9530  [TO220BV]
R34  220  R-EU_0207/10  [0207/10]
R35  1k  R-EU_0207/10  [0207/10]
S2  255SB  [255SB]

### Nets
CE: JP6.1 ; also sheet 1
CF: JP6.5 ; also sheet 3
CLK: JP6.2 ; also sheet 1,2,3,4,5
GND: D1.A J1.2 J1.3 JP1.3 JP1.4 Q1.G R35.1 ; also sheet 1,2,3,4,5
N$44: Q1.S Q2.S Q3.S R34.2
N$47: D1.C Q2.G R34.1
N$48: Q3.D S2.2(P)
N$49: Q2.D Q3.G R35.2
N_AI: JP6.10 ; also sheet 2
N_AO: JP6.11 ; also sheet 2
N_BI: JP6.13 ; also sheet 4
N_CLR: JP6.8 ; also sheet 1,5
N_CO: JP6.14 ; also sheet 1
N_EO: JP6.12 ; also sheet 3
N_FI: JP6.7 ; also sheet 3
N_J: JP6.9 ; also sheet 1
OI: JP6.4 ; also sheet 5
SU: JP6.3 ; also sheet 3
VCC: JP1.1 JP1.2 S2.3(S) ; also sheet 1,2,3,4,5
VDD: J1.1 Q1.D
ZF: JP6.6 ; also sheet 3
Unconnected: S2.1(O)

### Notes on the sheet
- MAIN VOLTAGE ENTRANCE
- SIGNALS AND POWER 
  TO ANOTHER PCB
- MOUTING HOLES
- OVERVOLTAGE AND REVERSE POLARITY
                   PROTECTION

## Power pins joined to a net without a drawn wire
GND: IC1.10(GND) IC2.8(GND) IC3.8(GND) IC4.10(GND) IC5.8(GND) IC6.8(GND) IC7.10(GND) IC8.8(GND) IC9.7(P:GND) IC10.7(P:GND) IC11.7(P:GND) IC12.7(P:GND) IC13.8(GND) IC14.8(GND) IC15.10(GND) IC16.8(P:GND) IC18.13(P:GND) IC20.10(GND) IC21.7(P:GND) U2.8(GND)
VCC: IC1.20(VCC) IC2.16(VCC) IC3.16(VCC) IC4.20(VCC) IC5.16(VCC) IC6.16(VCC) IC7.20(VCC) IC8.16(VCC) IC9.14(P:VCC) IC10.14(P:VCC) IC11.14(P:VCC) IC12.14(P:VCC) IC13.16(VCC) IC14.16(VCC) IC15.20(VCC) IC16.16(P:VCC) IC18.5(P:VCC) IC20.20(VCC) IC21.14(P:VCC) U2.16(VCC)

## Library data of the parts
C1-C9 = rcl:C-EU: CAPACITOR, European symbol; SPICEPREFIX: C
D1 = diode:BZX55: Z DIODE
DIS5-DIS8 = display-hp:HD-H103: LED DISPLAY 1-character 7 segment, decimal point right; OC_FARNELL: unknown; OC_NEWARK: unknown
H1-H3 H5 H6 = holes:MOUNT-HOLE: MOUNTING HOLE with drill center marker
IC1 IC4 IC7 IC15 = 74xx-eu:74*245: Octal BUS TRANSCEIVER, 3-state
IC2 IC3 IC8 IC13 IC14 = 74xx-eu:74*173: 4-bit D type REGISTER, 3-state
IC5 IC6 = 74xx-eu:74*283: 4-bit binary FULL ADDER, fast carry
IC9 IC10 = 74xx-eu:74*86: Quad 2-input EXCLUSIVE-OR (XOR) gate
IC11 = 74xx-eu:74*02: Quad 2-input NOR gate
IC12 IC21 = 74xx-eu:74*08: Quad 2-input AND gate
IC16 = 74xx-eu:74*139: Dual 2-line to 4-line DECODER/DEMULTIPLEXER
IC17 = microchip:28*16A: CMOS EPROM 16 K (2 K x 8) Source: ww1.microchip.com/downloads/en/DeviceDoc/11125J.pdf; MPN: CAT28C16ALI-12; OC_FARNELL: 1718292; OC_NEWARK: 06R0648
IC18 = 74xx-eu:74*76: Dual J-K FLIP FLOP, preset and clear
IC19 = linear:*555: TIMER
IC20 = 74xx-eu:74*273: Octal D type FLIP FLOP, clear
J1 = con-jack:DCJ0303: DC POWER JACK Source: DCJ0303.pdf; OC_FARNELL: unknown; OC_NEWARK: unknown
JP1 = pinhead:PINHD-2X2: PIN HEADER
JP2 = pinhead:PINHD-1X4: PIN HEADER
JP3-JP5 JP7 = pinhead:PINHD-1X8: PIN HEADER
JP6 = pinhead:PINHD-2X7: PIN HEADER
LED1-LED30 = led:LED: LED OSRAM: - CHIPLED LG R971, LG N971, LY N971, LG Q971, LY Q971, LO R971, LY R971 LH N974, LH R974 LS Q976, LO Q976, LY Q976 LO Q996 - Hyper CHIPLED LW Q18S LB Q993, LB Q99A, LB R99A - SideLED LS A670, LO A670, LY A670, LG A670, LP A670 LB A673, LV A673, LT A673, LW A673 LH A674 LY A675 LS A676, LA A676, LO A676, LY A676, LW A676 LS A679, LY A679, LG A679 - Hyper Micro SIDELED® LS Y876, LA Y876, LO Y876, LY Y876 LT Y87S - SmartLED LW L88C, LW L88S LB L89C, LB L89S, LG L890 LS L89K, LO L89K, LY L89K LS L896, LA L896, LO L896, LY L896 - TOPLED LS T670, LO T670, LY T670, LG T670, LP T670 LSG T670, LSP T670, LSY T670, LOP T670, LYG T670 LG T671, LOG T671, LSG T671 LB T673, LV T673, LT T673, LW T673 LH T674 LS T676, LA T676, LO T676, LY T676, LB T676, LH T676, LSB T676, LW T676 LB T67C, LV T67C, LT T67C, LS T67K, LO T67K, LY T67K, LW E67C LS E67B, LA E67B, LO E67B, LY E67B, LB E67C, LV E67C, LT E67C LW T67C LS T679, LY T679, LG T679 LS T770, LO T770, LY T770, LG T770, LP T770 LB T773, LV T773, LT T773, LW T773 LH T774 LS E675, LA E675, LY E675, LS T675 LS T776, LA T776, LO T776, LY T776, LB T776 LHGB T686 LT T68C, LB T68C - Hyper Mini TOPLED® LB M676 - Mini TOPLED Santana® LG M470 LS M47K, LO M47K, LY M47K Source: http://www.osram.convergy.de LUXEON: - LUMILED® LXK2-PW12-R00, LXK2-PW12-S00, LXK2-PW14-U00, LXK2-PW14-V00 LXK2-PM12-R00, LXK2-PM12-S00, LXK2-PM14-U00 LXK2-PE12-Q00, LXK2-PE12-R00, LXK2-PE12-S00, LXK2-PE14-T00, LXK2-PE14-U00 LXK2-PB12-K00, LXK2-PB12-L00, LXK2-PB12-M00, LXK2-PB14-N00, LXK2-PB14-P00, LXK2-PB14-Q00 LXK2-PR12-L00, LXK2-PR12-M00, LXK2-PR14-Q00, LXK2-PR14-R00 LXK2-PD12-Q00, LXK2-PD12-R00, LXK2-PD12-S00 LXK2-PH12-R00, LXK2-PH12-S00 LXK2-PL12-P00, LXK2-PL12-Q00, LXK2-PL12-R00 Source: www.luxeon.com KINGBRIGHT: KA-3528ASYC Source: www.kingbright.com
Q1-Q3 = transistor-power:IRF9530: P-CHANNEL HEXFET POWER-MOS-FET Source: http://www.irf.com/product-info/datasheets/data/irf9530.pdf
R1-R35 = rcl:R-EU_: RESISTOR, European symbol; SPICEPREFIX: R
S1 S2 = switch:255SB: SLIDING SWITCH Distributor Buerklin, 11G810
U2 = oldchips:74*161: Synchronous 4-bit COUNTER with direct clear